# EAGLE design working (EAGLE 6.5.0)
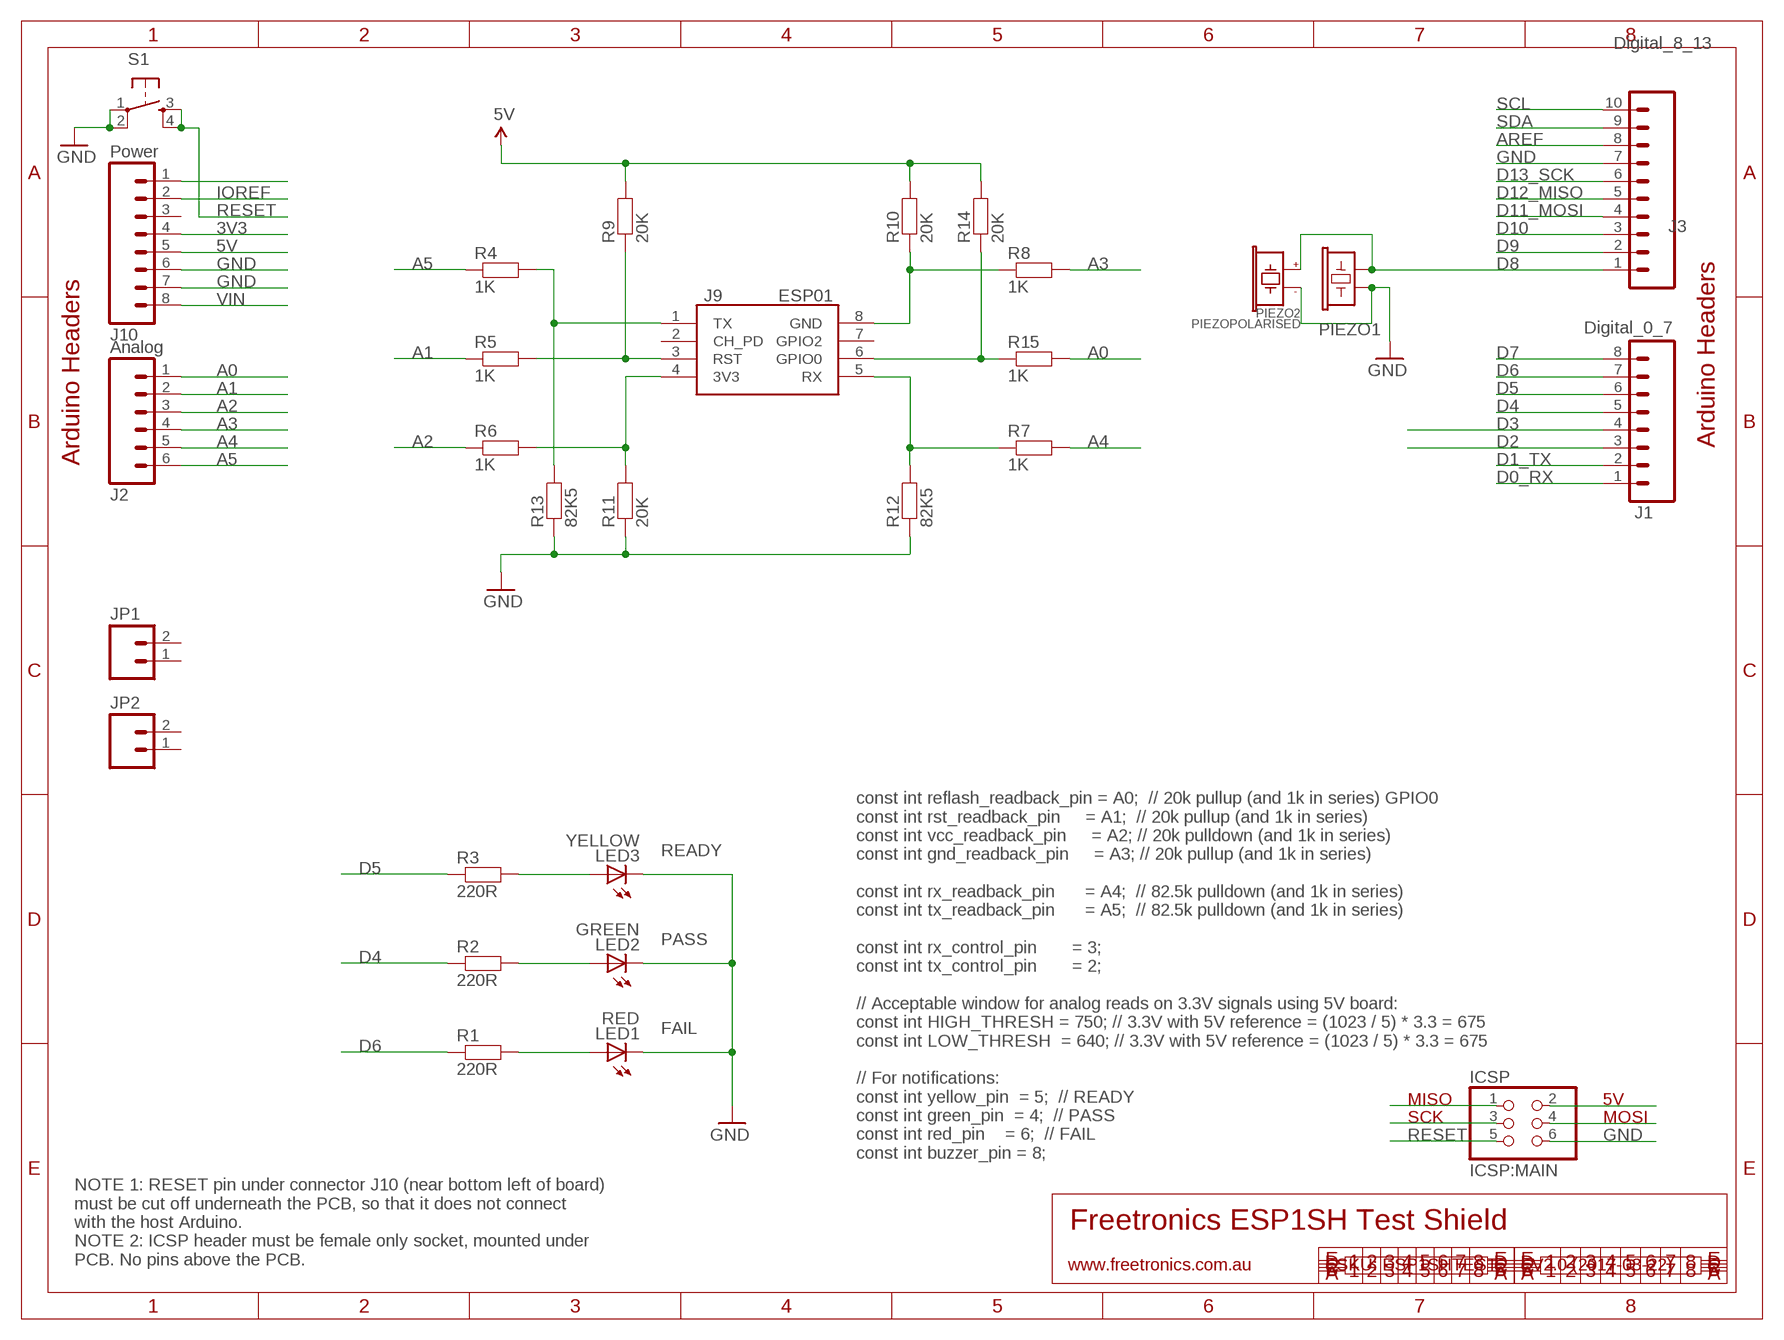
[diagram p0: schematic, sheet 1]

## Parts
ICSP  ICSP:MAIN  PINHD-2X3  [2X03]
J1  Digital_0_7  M08  [1X08]
J2  Analog  M06SIP  [1X06]
J3  Digital_8_13  M100.1  [1X10]
J9  ESP01  [ESP01]
J10  Power  M08  [1X08]
JP1  M02PTH  [1X02]
JP2  M02PTH  [1X02]
LED1  RED  LED0603  [LED-0603]
LED2  GREEN  LED0603  [LED-0603]
LED3  YELLOW  LED0603  [LED-0603]
PIEZO1  BUZZERSMD12X12  [BUZZER-12X12-SMT]
PIEZO2  PIEZOPOLARISED  [PIEZO12MMWIDEPOLARISED]
R1  220R  RESISTOR0603  [0603]
R2  220R  RESISTOR0603  [0603]
R3  220R  RESISTOR0603  [0603]
R4  1K  RESISTOR0603  [0603]
R5  1K  RESISTOR0603  [0603]
R6  1K  RESISTOR0603  [0603]
R7  1K  RESISTOR0603  [0603]
R8  1K  RESISTOR0603  [0603]
R9  20K  RESISTOR0603  [0603]
R10  20K  RESISTOR0603  [0603]
R11  20K  RESISTOR0603  [0603]
R12  82K5  RESISTOR0603  [0603]
R13  82K5  RESISTOR0603  [0603]
R14  20K  RESISTOR0603  [0603]
R15  1K  RESISTOR0603  [0603]
S1  TAC_SWITCHPTH  [TACTILE-PTH]

## Nets
3V3: J10.4
5V: J10.5 R9.2 R10.2 R14.2
A0: J2.1 R15.2
A1: J2.2 R5.1
A2: J2.3 R6.1
A3: J2.4 R8.2
A4: J2.5 R7.2
A5: J2.6 R4.1
AREF: J3.8
D0_RX: J1.1
D1_TX: J1.2
D2: J1.3
D3: J1.4
D4: J1.5 R2.1
D5: J1.6 R3.1
D6: J1.7 R1.1
D7: J1.8
D8: J3.1 PIEZO1.1 PIEZO2.1(+)
D9: J3.2
D10: J3.3
D11_MOSI: J3.4
D12_MISO: J3.5
D13_SCK: J3.6
GND: ICSP.6 J3.7 J10.6 J10.7 LED1.C LED2.C LED3.C PIEZO1.2 PIEZO2.2(-) R11.1 R12.1 R13.1 S1.1 S1.2
IOREF: J10.2
N$1: LED3.A R3.2
N$2: LED2.A R2.2
N$3: LED1.A R1.2
N$4: J9.3(RST) R5.2 R9.1
N$5: J9.8(GND) R8.1 R10.1
N$6: J9.4(3V3) R6.2 R11.2
N$7: J9.5(RX) R7.1 R12.2
N$8: J9.1(TX) R4.2 R13.2
N$9: J9.6(GPIO0) R14.1 R15.1
N$186: ICSP.1
N$187: ICSP.3
N$197: ICSP.2
N$198: ICSP.4
N$314: J10.1
RESET: ICSP.5 S1.3 S1.4
SCL: J3.10
SDA: J3.9
VIN: J10.8
Unconnected: J9.2(CH_PD) J9.7(GPIO2) J10.3 JP1.1 JP1.2 JP2.1 JP2.2

## Notes on the sheet
- Arduino Headers
- Arduino Headers
- READY
- PASS
- FAIL
- MISO | 5V
- SCK | MOSI
- const int reflash_readback_pin = A0;  // 20k pullup (and 1k in series) GPIO0
  const int rst_readback_pin     = A1;  // 20k pullup (and 1k in series)
  const int vcc_readback_pin     = A2; // 20k pulldown (and 1k in series)
  const int gnd_readback_pin     = A3; // 20k pullup (and 1k in series)
  
  const int rx_readback_pin      = A4;  // 82.5k pulldown (and 1k in series)
  const int tx_readback_pin      = A5;  // 82.5k pulldown (and 1k in series)
  
  const int rx_control_pin       = 3;
  const int tx_control_pin       = 2;
  
  // Acceptable window for analog reads on 3.3V signals using 5V board:
  const int HIGH_THRESH = 750; // 3.3V with 5V reference = (1023 / 5) * 3.3 = 675
  const int LOW_THRESH  = 640; // 3.3V with 5V reference = (1023 / 5) * 3.3 = 675
  
  // For notifications:
  const int yellow_pin  = 5;  // READY
  const int green_pin  = 4;  // PASS
  const int red_pin    = 6;  // FAIL
  const int buzzer_pin = 8;
- Freetronics ESP1SH Test Shield
- NOTE 1: RESET pin under connector J10 (near bottom left of board)
  must be cut off underneath the PCB, so that it does not connect
  with the host Arduino.
  NOTE 2: ICSP header must be female only socket, mounted under
  PCB. No pins above the PCB.
- www.freetronics.com.au | SKU: ESP1SHTEST | V2.0 (2017-03-22)

## Library data of the parts
ICSP = pinhead:PINHD-2X3: PIN HEADER
J1 = freetronics:M08: Header 8 Standard 8-pin 0.1" header. Use with straight break away headers (SKU : PRT-00116), right angle break away headers (PRT-00553), swiss pins (PRT-00743), machine pins (PRT-00117), and female headers (PRT-00115).
J2 = freetronics-master-v1.1:M06: Header 6 Standard 6-pin 0.1" header. Use with straight break away headers (SKU : PRT-00116), right angle break away headers (PRT-00553), swiss pins (PRT-00743), machine pins (PRT-00117), and female headers (PRT-00115). Molex polarized connector foot print use with SKU : PRT-08094 with associated crimp pins and housings. NOTES ON THE VARIANTS LOCK and LOCK_LONGPADS... This footprint was designed to help hold the alignment of a through-hole component (i.e. 6-pin header) while soldering it into place. You may notice that each hole has been shifted either up or down by 0.005 of an inch from it's more standard position (which is a perfectly straight line). This slight alteration caused the pins (the squares in the middle) to touch the edges of the holes. Because they are alternating, it causes a "brace" to hold the component in place. 0.005 has proven to be the perfect amount of "off-center" position when using our standard breakaway headers. Although looks a little odd when you look at the bare footprint, once you have a header in there, the alteration is very hard to notice. Also, if you push a header all the way into place, it is covered up entirely on the bottom side. This idea of altering the position of holes to aid alignment will be further integrated into the Sparkfun Library for other footprints. It can help hold any component with 3 or more connection pins.
J3 = freetronics-original:M10: Header 10 Standard 10-pin 0.1" header. Use with straight break away headers (SKU : PRT-00116), right angle break away headers (PRT-00553), swiss pins (PRT-00743), machine pins (PRT-00117), and female headers (PRT-00115).
J9 = freetronics-jon:ESP01
J10 = freetronics-master-v1:M08: Header 8 Standard 8-pin 0.1" header. Use with straight break away headers (SKU : PRT-00116), right angle break away headers (PRT-00553), swiss pins (PRT-00743), machine pins (PRT-00117), and female headers (PRT-00115).
JP1 JP2 = freetronics-master-v1:M02: Header 2 Standard 2-pin 0.1" header. Use with straight break away headers (SKU : PRT-00116), right angle break away headers (PRT-00553), swiss pins (PRT-00743), machine pins (PRT-00117), and female headers (PRT-00115). Molex polarized connector foot print use with SKU : PRT-08233 with associated crimp pins and housings.
LED1-LED3 = freetronics-jon:LED: LEDs Standard schematic elements and footprints for 5mm, 3mm, 1206, and 0603 sized LEDs. 5mm - Spark Fun Electronics SKU : COM-00529 (and others)
PIEZO1 = freetronics-master-v1:BUZZER: Buzzer - Piezo Transducer
PIEZO2 = freetronics-jon:PIEZOPOLARISED
R1-R15 = freetronics-jon:RESISTOR: Resistor Basic schematic elements and footprints for 0603, 1206, and PTH 1/10th watt (small) resistors.
S1 = freetronics-master-v1:TAC_SWITCH: Momentary Switch Button commonly used for reset or general input. Spark Fun Electronics SKU : COM-00097

## Board
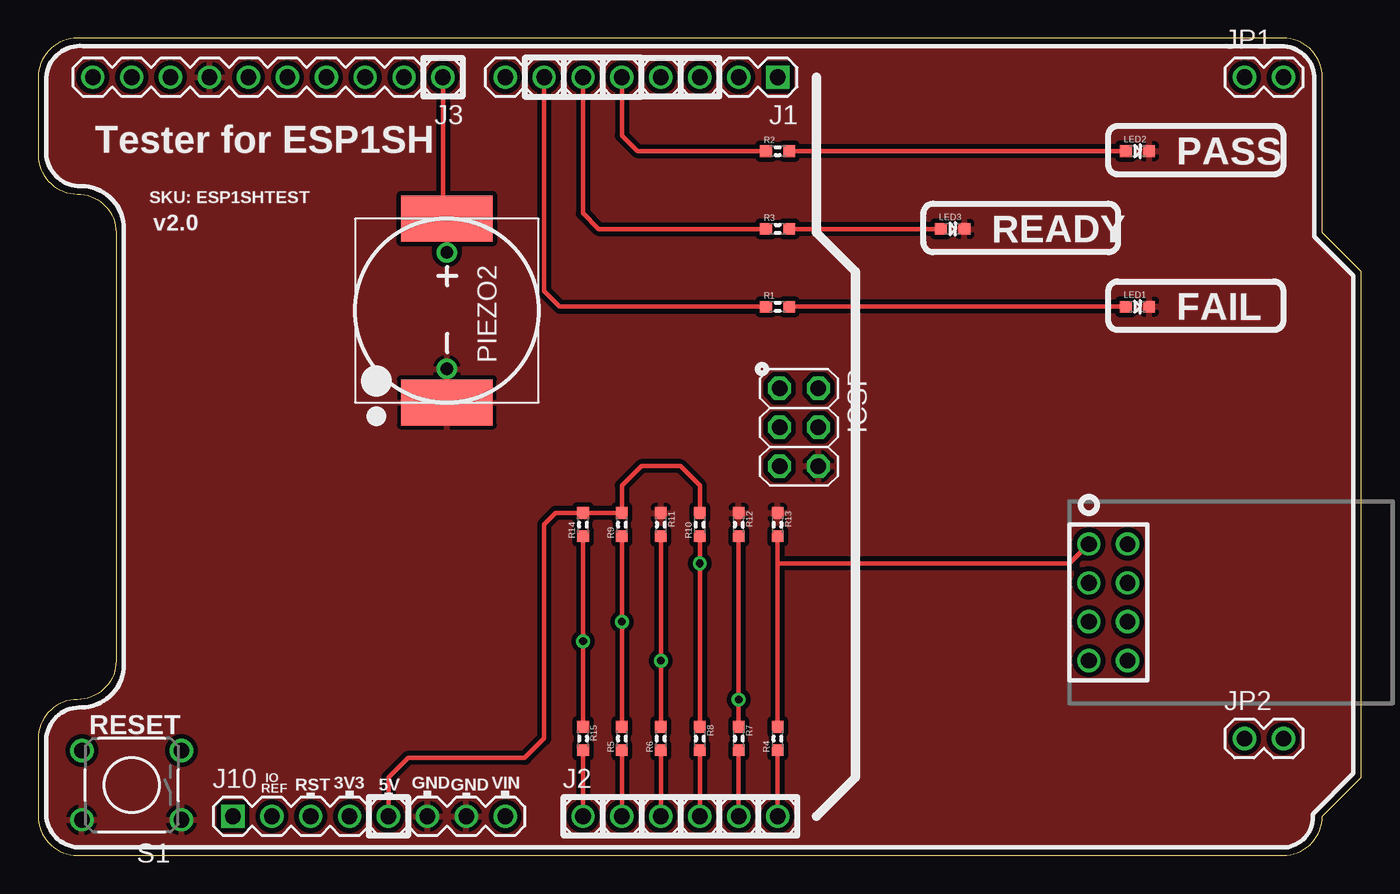
[diagram p1: board, top side]
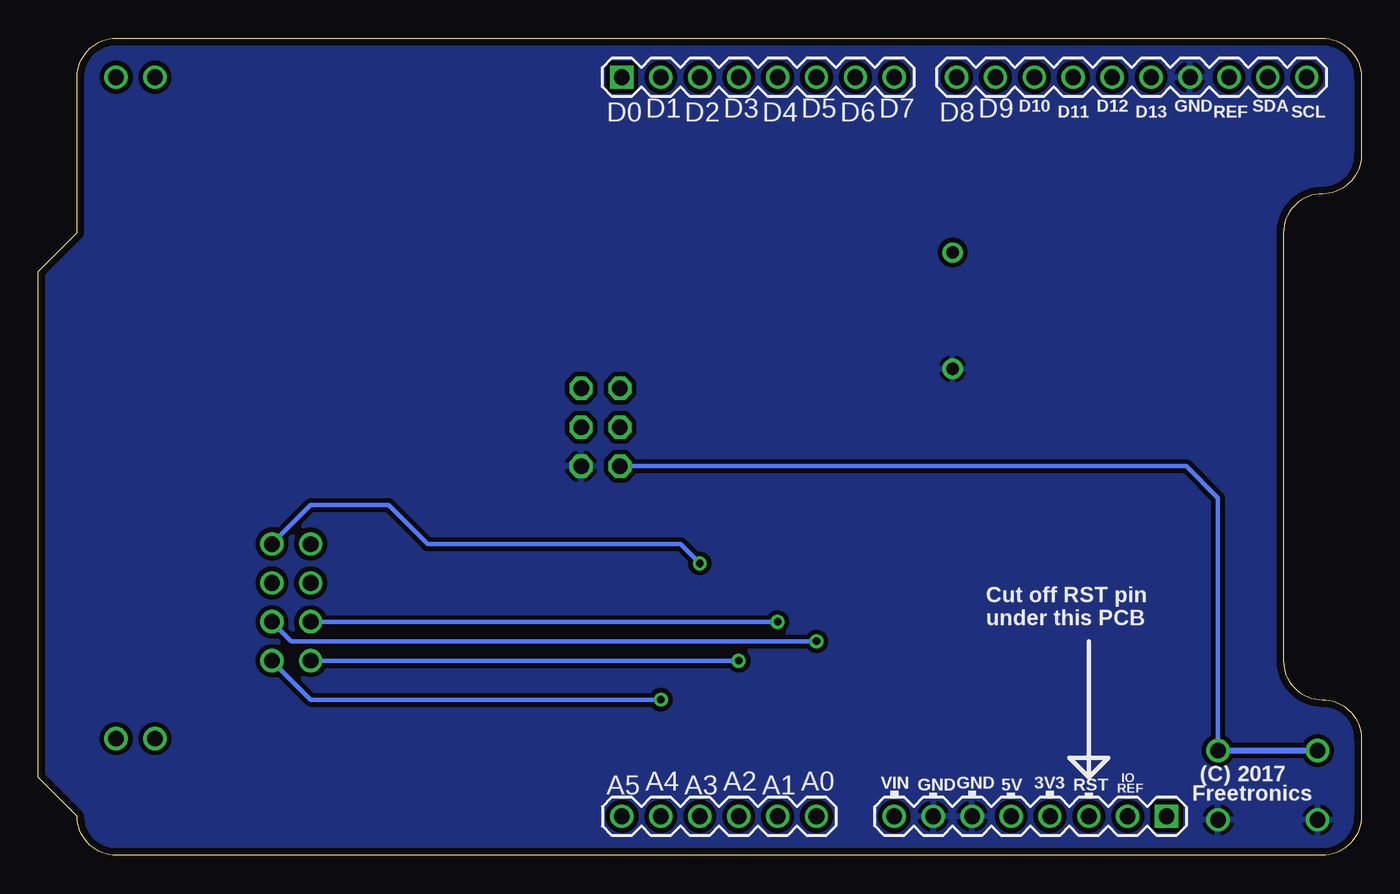
[diagram p2: board, bottom side, seen from below]

Size 86.36 x 53.34 mm. Coordinates in mm from the lower left corner, seen from the top.
Outline: 0,2.54 arc90 2.54,0 81.28,0 arc90 83.82,2.54 86.36,5.08 86.36,38.1 83.82,40.64 83.82,50.8 arc90 81.28,53.34 2.54,53.34 arc90 0,50.8 0,45.72 arc90 2.54,43.18 arc-90 5.08,40.64 5.08,12.7 arc-90 2.54,10.16 arc90 0,7.62 0,2.54
Copper layers (1*16): Top 0.035mm / dielectric 1.5mm / Bottom 0.035mm
Design rules "default *": minimum track width 10mil, minimum drill 24mil, track to track 12mil, track to pad 12mil, pad to pad 12mil, via to via 12mil, smd to smd 8mil, copper to edge 18mil, drill to drill 8mil, minimum pad ring 10mil, minimum via ring 8mil, stop-mask expansion 4mil, vias tented up to drill 0mil, thermal gap 10mil

### Footprints (pad centres in the part's own frame; a part is rotated, then mirrored left to right if it is on the bottom)
2X03 = drill 1.016 octagon: 1 -2.54,-1.27; 2 -2.54,1.27; 3 0,-1.27; 4 0,1.27; 5 2.54,-1.27; 6 2.54,1.27
1X08 = drill 1.016 square: 1 0,0 | drill 1.016: 2 2.54,0; 3 5.08,0; 4 7.62,0; 5 10.16,0; 6 12.7,0; 7 15.24,0; 8 17.78,0
1X06 = drill 1.016: 1 0,0; 2 2.54,0; 3 5.08,0; 4 7.62,0; 5 10.16,0; 6 12.7,0
1X10 = drill 1.016: 1 0,0; 2 2.54,0; 3 5.08,0; 4 7.62,0; 5 10.16,0; 6 12.7,0; 7 15.24,0; 8 17.78,0; 9 20.32,0; 10 22.86,0
ESP01 = drill 1.016: 1 -1.27,3.81; 2 -1.27,1.27; 3 -1.27,-1.27; 4 -1.27,-3.81; 5 1.27,-3.81; 6 1.27,-1.27; 7 1.27,1.27; 8 1.27,3.81
1X02 = drill 1.016: 1 0,0; 2 2.54,0
LED-0603 = smd 0.762 x 0.762: A -0.762,0; C 0.762,0
BUZZER-12X12-SMT = smd 3 x 6: 1 -6,0; 2 6,0
PIEZO12MMWIDEPOLARISED = drill 0.8: 1 -3.8,0; 2 3.8,0
0603 = smd 0.762 x 0.762: 1 -0.762,0; 2 0.762,0
TACTILE-PTH = drill 1.016: 1 -3.251,2.261; 2 3.251,2.261; 3 -3.251,-2.261; 4 3.251,-2.261

### Placement (x,y rotation side)
ICSP  49.66,27.94 270 top
J1  48.26,50.8 180 top
J2  35.56,2.54 0 top
J3  26.42,50.8 180 top
J9  69.85,16.51 0 top
J10  12.7,2.54 0 top
JP1  78.74,50.8 0 top
JP2  78.74,7.62 0 top
LED1  71.75,35.81 0 top
LED2  71.75,45.97 0 top
LED3  59.69,40.89 0 top
PIEZO1  26.67,35.56 270 top
PIEZO2  26.67,35.56 270 top
R1  48.26,35.81 0 top
R2  48.26,45.97 0 top
R3  48.26,40.89 0 top
R4  48.26,7.62 90 top
R5  38.1,7.62 90 top
R6  40.64,7.62 90 top
R7  45.72,7.62 270 top
R8  43.18,7.62 270 top
R9  38.1,21.59 90 top
R10  43.18,21.59 90 top
R11  40.64,21.59 270 top
R12  45.72,21.59 270 top
R13  48.26,21.59 270 top
R14  35.56,21.59 90 top
R15  35.56,7.62 270 top
S1  6.1,4.57 180 top

### Tracks (layer width: path | path; a pad name or v marks a point on that pad's centre or on a via)
5V
  Top 0.305: R10.2 43.18,24.13 41.91,25.4 39.37,25.4 38.1,24.13 R9.2 R14.2 33.78,22.35 33.02,21.59 33.02,7.62 31.75,6.35 24.13,6.35 22.86,5.08 J10.5
A0
  Top 0.305: R15.2 J2.1
A1
  Top 0.305: R5.1 J2.2
A2
  Top 0.305: R6.1 J2.3
A3
  Top 0.305: R8.2 J2.4
A4
  Top 0.305: R7.2 J2.5
A5
  Top 0.305: R4.1 J2.6
D4
  Top 0.305: J1.5 38.1,46.99 39.12,45.97 R2.1
D5
  Top 0.305: J1.6 35.56,41.91 36.58,40.89 R3.1
D6
  Top 0.305: J1.7 33.02,36.83 34.04,35.81 R1.1
D8
  Top 0.305: J3.1 26.42,41.66 26.67,40.64 | PIEZO2.1 26.67,40.64 | 26.67,40.64 PIEZO1.1
GND
  pour Bottom: 0,50.8 arc-74 2.54,53.34 81.28,53.34 arc-74 83.82,50.8 83.82,40.64 86.36,38.1 86.36,5.08 83.82,2.54 arc-74 81.28,0 1.27,0 arc-74 0,2.54 0,7.62 arc-90 2.54,10.16 arc90 5.08,12.7 5.08,40.64 arc90 2.54,43.18 arc-90 0,45.72
  pour Top: 0,50.8 arc-74 2.54,53.34 81.28,53.34 arc-74 83.82,50.8 83.82,40.64 86.36,38.1 86.36,5.08 83.82,2.54 arc-74 81.28,0 1.27,0 arc-74 0,2.54 0,7.62 arc-90 2.54,10.16 arc90 5.08,12.7 5.08,40.64 arc90 2.54,43.18 arc-90 0,45.72
N$1
  Top 0.305: LED3.A R3.2
N$2
  Top 0.305: LED2.A R2.2
N$3
  Top 0.305: LED1.A R1.2
N$4  (via drill 0.5)
  Top 0.305: R9.1 v38.1,15.24 R5.2
  Bottom 0.305: J9.3 v38.1,15.24
N$5  (via drill 0.5)
  Top 0.305: R10.1 v43.18,19.05 R8.1
  Bottom 0.305: J9.8 68.58,22.86 63.5,22.86 60.96,20.32 44.45,20.32 v43.18,19.05
N$6  (via drill 0.5)
  Top 0.305: R11.2 v40.64,12.7 R6.2
  Bottom 0.305: J9.4 v40.64,12.7
N$7  (via drill 0.5)
  Top 0.305: R12.2 v45.72,10.16 R7.1
  Bottom 0.305: J9.5 68.58,10.16 v45.72,10.16
N$8
  Top 0.305: R13.2 48.26,19.05 | 48.26,19.05 R4.2 | J9.1 67.31,19.05 48.26,19.05
N$9  (via drill 0.5)
  Top 0.305: R14.1 v35.56,13.97 R15.1
  Bottom 0.305: J9.6 69.85,13.97 v35.56,13.97
RESET
  Bottom 0.305: ICSP.5 11.43,25.4 9.35,23.32 S1.3
  Bottom 0.406: S1.3 S1.4

### Text on the board
tPlace: Tester for ESP1SH | PASS | SKU: ESP1SHTEST | v2.0 | READY | FAIL | RESET | IO | REF | RST | 3V3 | 5V | GND | GND | VIN
bPlace: SDA | GND | D12 | D10 | SCL | REF | D13 | D11 | D9 | D8 | D7 | D6 | D5 | D4 | D3 | D2 | D1 | D0 | Cut off RST pin / under this PCB | (C) 2017 | IO | Freetronics | REF | RST | 3V3 | 5V | GND | GND | VIN | A0 | A1 | A2 | A3 | A4 | A5